# EAGLE design bottle-light (EAGLE 9.4.2)
DATE: 04.07.2019; EDITOR: Hans Achterbahn; LICENSE: MIT License; PROJECT: Bottle Light; VERSION: v0.2.8

## Sheet 1 of 2
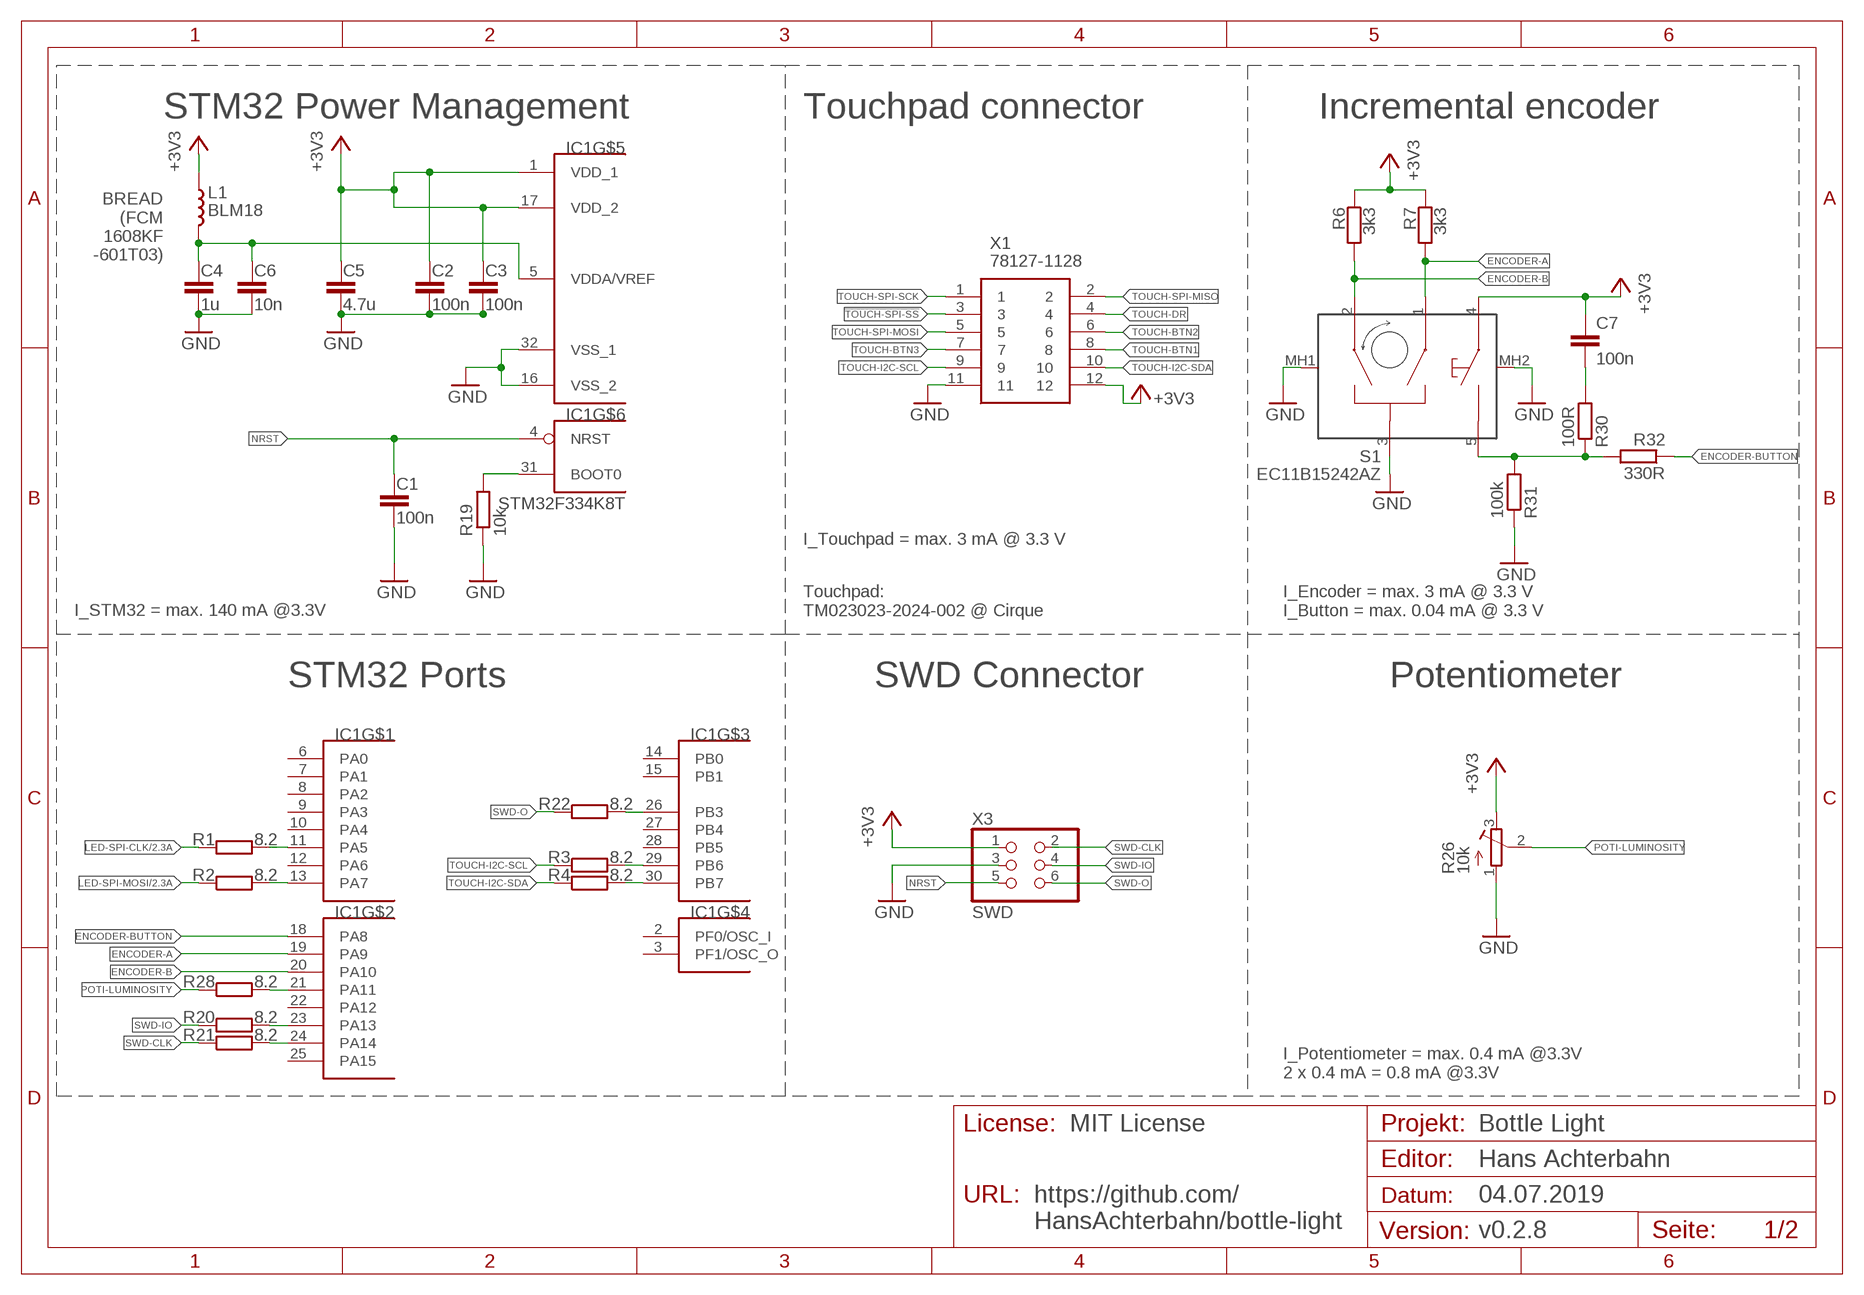
[diagram p0: schematic, sheet 1]

### Parts
C1  100n  C-EUC0603K  [C0603K]
C2  100n  C-EUC0603K  [C0603K]
C3  100n  C-EUC0603K  [C0603K]
C4  1u  C-EUC0603K  [C0603K]
C5  4.7u  C-EUC0603K  [C0603K]
C6  10n  C-EUC0603K  [C0603K]
C7  100n  C-EUC0603  [C0603]
IC1  STM32F334K8T  [LQFP32-7X7]
L1  BLM18  INDUCTOR/FERRITE-BEAD'0603'  [L0603]
R1  8.2  R-EU_R0603  [R0603]
R2  8.2  R-EU_R0603  [R0603]
R3  8.2  R-EU_R0603  [R0603]
R4  8.2  R-EU_R0603  [R0603]
R6  3k3  R-EU_R0603  [R0603]
R7  3k3  R-EU_R0603  [R0603]
R19  10k  R-EU_R0603  [R0603]
R20  8.2  R-EU_R0603  [R0603]
R21  8.2  R-EU_R0603  [R0603]
R22  8.2  R-EU_R0603  [R0603]
R26  10k  RK0971110  [RK0971110]
R28  8.2  R-EU_R0603  [R0603]
R30  100R  R-EU_R0603  [R0603]
R31  100k  R-EU_R0603  [R0603]
R32  330R  R-EU_R0603  [R0603]
S1  EC11B15242AZ  [EC11B15242AZ]
X1  78127-1128  [781271128]
X3  SWD  PINHD-2X3_2.54-SMD  [2X03SMD]

### Nets
!TOUCH-SPI-SS: X1.3
+3V3: C2.1 C3.1 C5.1 C7.1 IC1.1(VDD_1) IC1.17(VDD_2) L1.1 R6.1 R7.1 R26.3(E) S1.4(D) X1.12 X3.1 ; also sheet 2
ENCODER-A: IC1.19(PA9) R7.2 S1.1(A)
ENCODER-B: IC1.20(PA10) R6.2 S1.2(B)
ENCODER-BUTTON: IC1.18(PA8) R32.1
GND: C1.2 C2.2 C3.2 C4.2 C5.2 C6.2 IC1.16(VSS_2) IC1.32(VSS_1) R19.1 R26.1(A) R31.1 S1.3(C) S1.MH1 S1.MH2 X1.11 X3.3 ; also sheet 2
LED-SPI-CLK: R1.1 ; also sheet 2
LED-SPI-MOSI: R2.1 ; also sheet 2
N$1: IC1.24(PA14) R21.2
N$2: IC1.11(PA5) R1.2
N$3: IC1.13(PA7) R2.2
N$4: IC1.29(PB6) R3.2
N$5: IC1.30(PB7) R4.2
N$6: IC1.21(PA11) R28.2
N$7: C4.1 C6.1 IC1.5(VDDA/VREF) L1.2
N$23: IC1.31(BOOT0) R19.2
N$24: IC1.23(PA13) R20.2
N$25: IC1.26(PB3) R22.2
N$30: R30.1 R31.2 R32.2 S1.5(E)
N$31: C7.2 R30.2
NRST: C1.1 IC1.4(NRST) X3.5
POTI-LUMINOSITY: R26.2(S) R28.1
SWD-CLK: R21.1 X3.2
SWD-IO: R20.1 X3.4
SWD-O: R22.1 X3.6
TOUCH-BTN1: X1.8
TOUCH-BTN2: X1.6
TOUCH-BTN3: X1.7
TOUCH-DR: X1.4
TOUCH-I2C-SCL: R3.1 X1.9
TOUCH-I2C-SDA: R4.1 X1.10
TOUCH-SPI-MISO: X1.2
TOUCH-SPI-MOSI: X1.5
TOUCH-SPI-SCK: X1.1
Unconnected: IC1.2(PF0/OSC_I) IC1.3(PF1/OSC_O) IC1.6(PA0) IC1.7(PA1) IC1.8(PA2) IC1.9(PA3) IC1.10(PA4) IC1.12(PA6) IC1.14(PB0) IC1.15(PB1) IC1.22(PA12) IC1.25(PA15) IC1.27(PB4) IC1.28(PB5)

### Notes on the sheet
- STM32 Power Management | Touchpad connector | Incremental encoder
- BREAD
  (FCM
  1608KF
  -601T03)
- I_Touchpad = max. 3 mA @ 3.3 V
- I_STM32 = max. 140 mA @3.3V
- Touchpad:
  TM023023-2024-002 @ Cirque
- I_Encoder = max. 3 mA @ 3.3 V
  I_Button = max. 0.04 mA @ 3.3 V
- STM32 Ports | SWD Connector | Potentiometer
- I_Potentiometer = max. 0.4 mA @3.3V
  2 x 0.4 mA = 0.8 mA @3.3V
- License:
- URL:
- https://github.com/
  HansAchterbahn/bottle-light

## Sheet 2 of 2
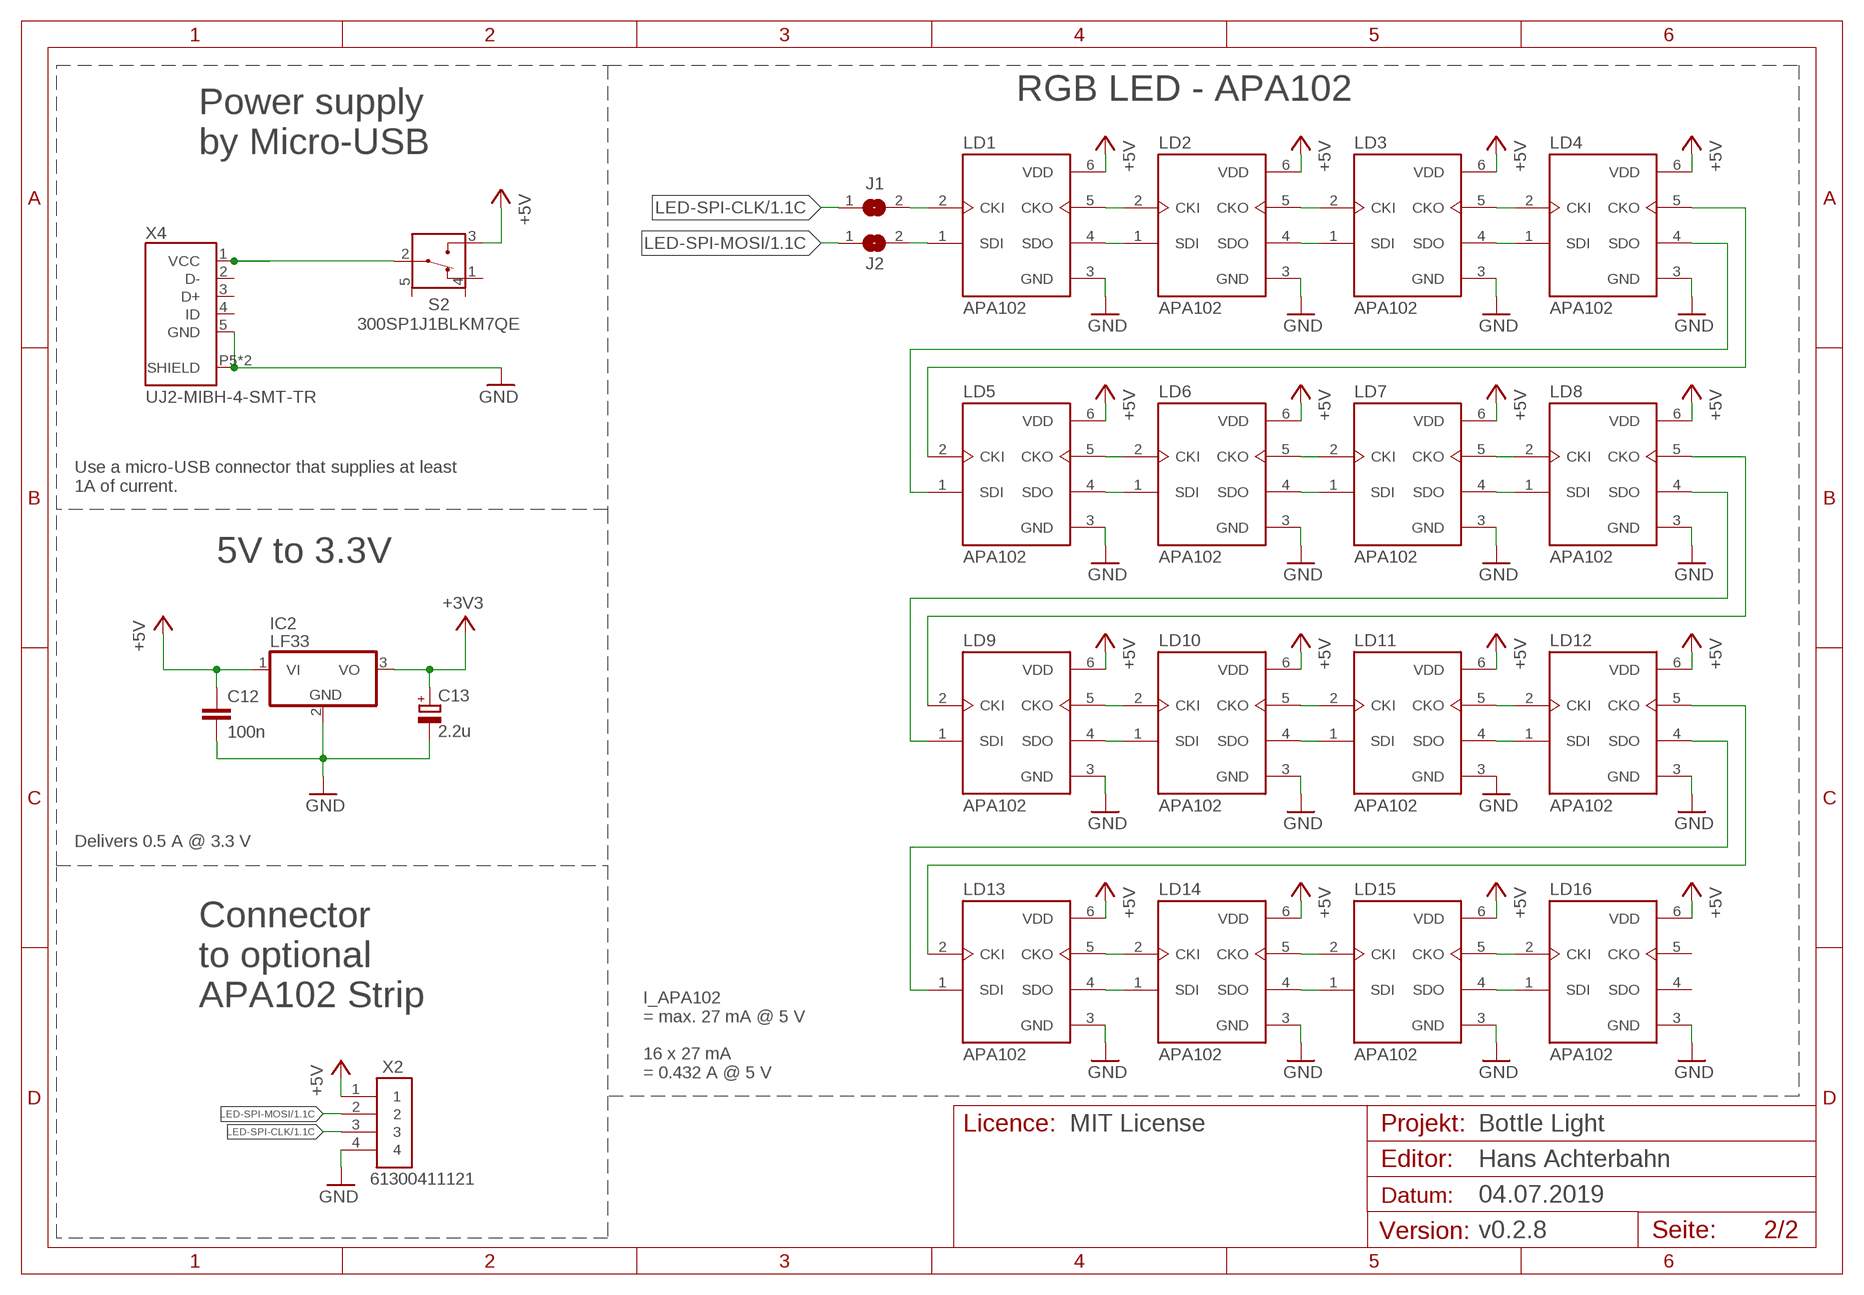
[diagram p1: schematic, sheet 2]

### Parts
C12  100n  C-EUC0603  [C0603]
C13  2.2u  CPOL-EU153CLV-0505  [153CLV-0505]
IC2  LF33  7805T  [TO220H]
J1  SJ  [SJ]
J2  SJ  [SJ]
LD1  APA102  APA102APA102C-5050  [APA102C-5050]
LD2  APA102  APA102APA102C-5050  [APA102C-5050]
LD3  APA102  APA102APA102C-5050  [APA102C-5050]
LD4  APA102  APA102APA102C-5050  [APA102C-5050]
LD5  APA102  APA102APA102C-5050  [APA102C-5050]
LD6  APA102  APA102APA102C-5050  [APA102C-5050]
LD7  APA102  APA102APA102C-5050  [APA102C-5050]
LD8  APA102  APA102APA102C-5050  [APA102C-5050]
LD9  APA102  APA102APA102C-5050  [APA102C-5050]
LD10  APA102  APA102APA102C-5050  [APA102C-5050]
LD11  APA102  APA102APA102C-5050  [APA102C-5050]
LD12  APA102  APA102APA102C-5050  [APA102C-5050]
LD13  APA102  APA102APA102C-5050  [APA102C-5050]
LD14  APA102  APA102APA102C-5050  [APA102C-5050]
LD15  APA102  APA102APA102C-5050  [APA102C-5050]
LD16  APA102  APA102APA102C-5050  [APA102C-5050]
S2  300SP1J1BLKM7QE  [300SP1J1BLKM7QE]
X2  61300411121  [61300411121]
X4  UJ2-MIBH-4-SMT-TR  UJ2-MIBH-4-SMT-TRCUIINC_UJ2-MIBH-4-SMT-TR-2  [CUIINC_UJ2-MIBH-4-SMT-TR-2]

### Nets
5V-IN: S2.2(IN) X4.1(VCC)
+3V3: C13.+ IC2.3(VO) ; also sheet 1
+5V: C12.1 IC2.1(VI) LD1.6(VDD) LD2.6(VDD) LD3.6(VDD) LD4.6(VDD) LD5.6(VDD) LD6.6(VDD) LD7.6(VDD) LD8.6(VDD) LD9.6(VDD) LD10.6(VDD) LD11.6(VDD) LD12.6(VDD) LD13.6(VDD) LD14.6(VDD) LD15.6(VDD) LD16.6(VDD) S2.3(OUT1) X2.1
GND: C12.2 C13.- IC2.2(GND) LD1.3(GND) LD2.3(GND) LD3.3(GND) LD4.3(GND) LD5.3(GND) LD6.3(GND) LD7.3(GND) LD8.3(GND) LD9.3(GND) LD10.3(GND) LD11.3(GND) LD12.3(GND) LD13.3(GND) LD14.3(GND) LD15.3(GND) LD16.3(GND) X2.4 X4.5(GND) X4.P5(SHIELD) X4.P6(SHIELD) ; also sheet 1
LED-SPI-CLK: J1.1 X2.3 ; also sheet 1
LED-SPI-MOSI: J2.1 X2.2 ; also sheet 1
N$8: J1.2 LD1.2(CKI)
N$9: J2.2 LD1.1(SDI)
N$37: LD1.5(CKO) LD2.2(CKI)
N$39: LD1.4(SDO) LD2.1(SDI)
N$40: LD2.5(CKO) LD3.2(CKI)
N$41: LD2.4(SDO) LD3.1(SDI)
N$42: LD3.5(CKO) LD4.2(CKI)
N$43: LD3.4(SDO) LD4.1(SDI)
N$44: LD4.5(CKO) LD5.2(CKI)
N$45: LD4.4(SDO) LD5.1(SDI)
N$46: LD5.5(CKO) LD6.2(CKI)
N$47: LD5.4(SDO) LD6.1(SDI)
N$48: LD6.5(CKO) LD7.2(CKI)
N$49: LD6.4(SDO) LD7.1(SDI)
N$50: LD7.5(CKO) LD8.2(CKI)
N$51: LD7.4(SDO) LD8.1(SDI)
N$52: LD8.5(CKO) LD9.2(CKI)
N$53: LD8.4(SDO) LD9.1(SDI)
N$54: LD9.5(CKO) LD10.2(CKI)
N$55: LD9.4(SDO) LD10.1(SDI)
N$56: LD10.5(CKO) LD11.2(CKI)
N$57: LD10.4(SDO) LD11.1(SDI)
N$58: LD11.5(CKO) LD12.2(CKI)
N$59: LD11.4(SDO) LD12.1(SDI)
N$60: LD12.5(CKO) LD13.2(CKI)
N$61: LD12.4(SDO) LD13.1(SDI)
N$62: LD13.5(CKO) LD14.2(CKI)
N$63: LD13.4(SDO) LD14.1(SDI)
N$64: LD14.5(CKO) LD15.2(CKI)
N$65: LD14.4(SDO) LD15.1(SDI)
N$66: LD15.5(CKO) LD16.2(CKI)
N$67: LD15.4(SDO) LD16.1(SDI)
Unconnected: LD16.4(SDO) LD16.5(CKO) S2.1(OUT2) S2.4(NC1) S2.5(NC2) X4.2(D-) X4.3(D+) X4.4(ID)

### Notes on the sheet
- RGB LED - APA102
- Power supply
  by Micro-USB
- Use a micro-USB connector that supplies at least 
  1A of current.
- 5V to 3.3V
- Delivers 0.5 A @ 3.3 V
- Connector 
  to optional 
  APA102 Strip
- I_APA102
  = max. 27 mA @ 5 V
  
  16 x 27 mA 
  = 0.432 A @ 5 V
- Licence:

## Library data of the parts
C1-C3 = resistor:C-EU: CAPACITOR, European symbol; RS-ONLINE: 391-246
C4 = resistor:C-EU: CAPACITOR, European symbol; RS-ONLINE: 435-1403
C5 = resistor:C-EU: CAPACITOR, European symbol; RS-ONLINE: 691-1164
C6 = resistor:C-EU: CAPACITOR, European symbol; RS-ONLINE: 264-4595
C7 = resistor:C-EU: CAPACITOR, European symbol; MOUSER: 581-0603YC104J; ORIGINAL: AVX, 0603YC104JAT2A; RS-ONLINE: 391-246
C12 = rcl:C-EU: CAPACITOR, European symbol; SPICEPREFIX: C
C13 = rcl:CPOL-EU: POLARIZED CAPACITOR, European symbol; SPICEPREFIX: C
IC1 = h8-stm32:STM32F334K8T: STM32 Mikrocontroller: STM32F334K8Tx Documentary, Reference Manual and Datasheet: http://www.st.com/en/microcontrollers/stm32f334k8.html Created by Hans Achterbahn (https://github.com/HansAchterbahn)
IC2 = linear:78*: Positive VOLTAGE REGULATOR Source: http://cache.national.com/ds/LM/LM78L05.pdf http://www.fairchildsemi.com/ds/LM/LM7805.pdf
J1 J2 = jumper:SJ: SMD solder JUMPER
L1 = Seeed-OPL-Inductor:INDUCTOR/FERRITE-BEAD; MF: Murata; MFN: BLM18KG601SN1D; MOUSER: 81-BLM18KG601SN1D; RS-ONLINE: 747-4720
LD1-LD16 = h8-optic:APA102: DotStar Micro LEDs (APA102–2020)- Smart SMD RGB LED - 100 pack
R1-R4 R20-R22 R28 = resistor:R-EU_: RESISTOR, European symbol; RS-ONLINE: 904-5027
R6 R7 = rcl:R-EU_: RESISTOR, European symbol; MF: Vishay; MFN: CRCW06032K70FKEAC; MOUSER: 71-CRCW06032K70FKEAC; RS-ONLINE: -; SPICEPREFIX: R
R19 = resistor:R-EU_: RESISTOR, European symbol
R26 = h8-rlc:RK0971110: Potentiometer Manufacturer: Alps Part Nr.: RK097111080R Datasheet: https://www.mouser.de/datasheet/2/15/RK097-1370742.pdf Distributor: RS-Online: 729-3458 <https://de.rs-online.com/web/p/potenziometer/7293458/> Mouser: 688-RK097111080R <https://www.mouser.de/ProductDetail/ALPS/RK097111080R?qs=%2Fha2pyFaduhU4k0V7XWN8mIkeNZb2knvSkahcQwzToaQdR6BkxtXDw%3D%3D> Created by Hans Achterbahn (https://github.com/HansAchterbahn); MF: ALPS; MFN: RK097111080R; MOUSER: 688-RK097111080R; RS-ONLINE: 729-3458
R30 = rcl:R-EU_: RESISTOR, European symbol; MOUSER: 71-CRCW0603-100-E3; ORIGINAL: Vishay, CRCW0603100RFKEAHP; RS-ONLINE: 820-6748; SPICEPREFIX: R
R31 = rcl:R-EU_: RESISTOR, European symbol; MOUSER: 71-CRCW0603-100K-E3; ORIGINAL: Vishay, CRCW0603100KFKEA; RS-ONLINE: 678-9673; SPICEPREFIX: R
R32 = rcl:R-EU_: RESISTOR, European symbol; MOUSER: 71-CRCW0603-330-E3; ORIGINAL: Vishay, CRCW0603330RFKEA; RS-ONLINE: 679-0226; SPICEPREFIX: R
S1 = h8-switch:EC11B15242AZ: Komponente von www.SamacSys.com geforkt: https://componentsearchengine.com/part.php?partID=1029460&p=1 Encoders 5 Volts Through Hole Source: Datasheet <https://componentsearchengine.com/Datasheets/1/EC11B15242AZ.pdf> Edited by Hans Achterbahn (https://github.com/HansAchterbahn); DESCRIPTION: Encoders 5 Volts Through Hole; HEIGHT: 24mm; MANUFACTURER_NAME: ALPS; MANUFACTURER_PART_NUMBER: EC11B15242AZ; MF: ALPS; MOUSER: 688-EC11B15242AE; MOUSER_PART_NUMBER: 688-EC11B15242AE; MOUSER_PRICE-STOCK: https://www.mouser.com/Search/Refine.aspx?Keyword=688-EC11B15242AE; MPN: EC11B15242AZ
S2 = h8-switch:300SP1J1BLKM7QE: E-Switch - 300 Series Rocker Switch Production Data Manufacturer: E-Switch Part Number: 300SP1J1BLKM7QE Distributer: RS-Online: - Mouser: 612-300SP1J1BLKM7QE Datasheet: https://www.mouser.de/datasheet/2/140/300-346108.pdf Created by Hans Achterbahn (https://github.com/HansAchterbahn); MF: E-Switch; MFN: 300SP1J1BLKM7QE; MOUSER: 612-300SP1J1BLKM7QE; RS-ONLINE: -
X1 = h8-conector:78127-1128: FFC & FPC Connectors 0.5 FPC CONN. VERTIC AL SMT NON-ZIF 12CKT Source: Datasheet <https://www.molex.com/pdm_docs/sd/781271128_sd.pdf>; ALLIED_NUMBER: 70714305; ALLIED_PRICE-STOCK: https://www.alliedelec.com/molex-incorporated-78127-1128/70714305/; DESCRIPTION: FFC & FPC Connectors 0.5 FPC CONN. VERTIC AL SMT NON-ZIF 12CKT; HEIGHT: 4mm; MANUFACTURER_NAME: Molex; MANUFACTURER_PART_NUMBER: 78127-1128; MOUSER_PART_NUMBER: 538-78127-1128; MOUSER_PRICE-STOCK: https://www.mouser.com/Search/Refine.aspx?Keyword=538-78127-1128
X2 = Headers:61300411121: CONN HEADER VERT 4POS 2.54MM Manufacturer's datasheet <https://katalog.we-online.de/em/datasheet/6130xx11121.pdf>; CREATED_BY: PCBLayout.com; DIGI_KEY_PART_NUMBER: 732-5317-ND; MANUFACTURER: Wurth Electronics Inc.; MPN: 61300411121
X3 = h8-pinhead:PINHD-2X3: PIN HEADER; MOUSER: 855-M20-8760342; ORIGINAL: Harwin, M20-8760342; RS-ONLINE: 681-2880
X4 = UJ2-MIBH-4-SMT-TR:UJ2-MIBH-4-SMT-TR: Micro B Type 5 Pin Horizontal 30 µin Plating SMT USB Jack 2.0; DATASHEET: https://www.mouser.de/datasheet/2/670/uj2-mibh-4-smt-1313358.pdf; MF: CUI; MFN: UJ2-MIBH-4-SMT-TR; MOUSER: 490-UJ2-MIBH-4-SMT

## Net classes
0 default: width 0.2 mm, drill 0.2 mm, clearance 0.15 mm
1 Power: width 0.2 mm, drill 0.2 mm, clearance 0.15 mm

## Board
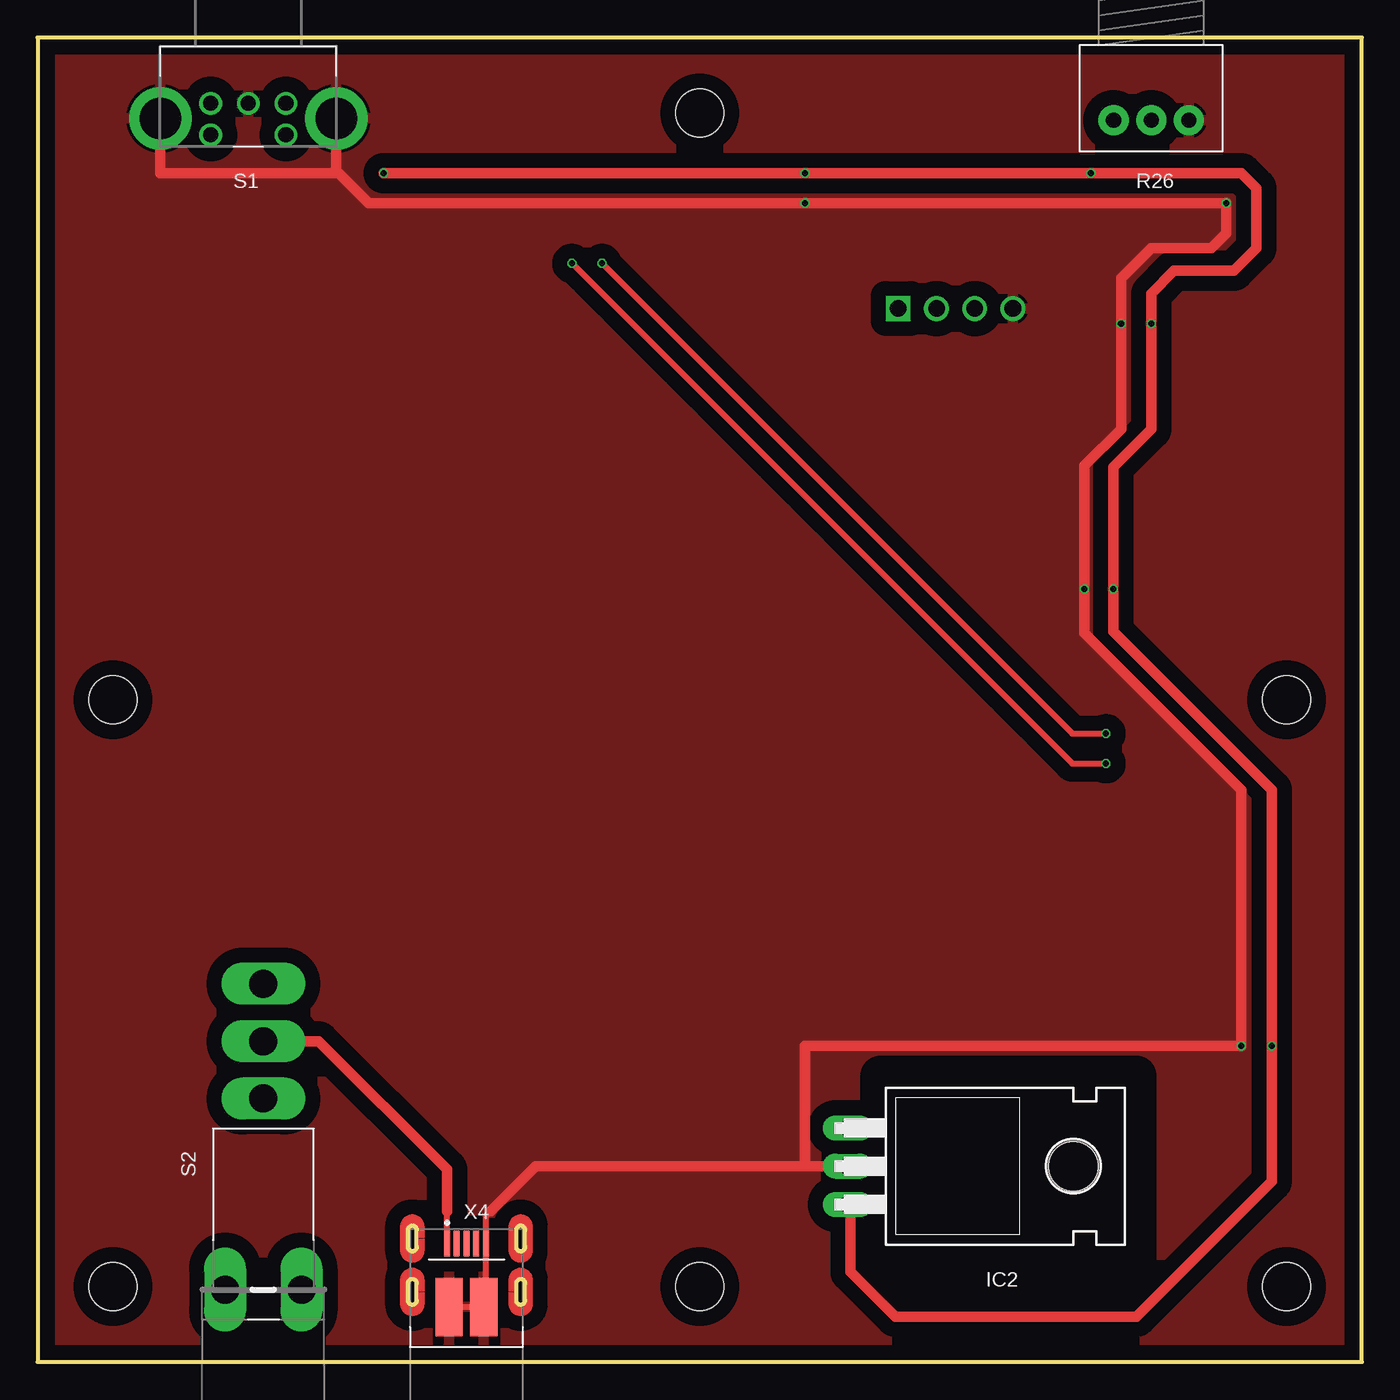
[diagram p2: board, top side]
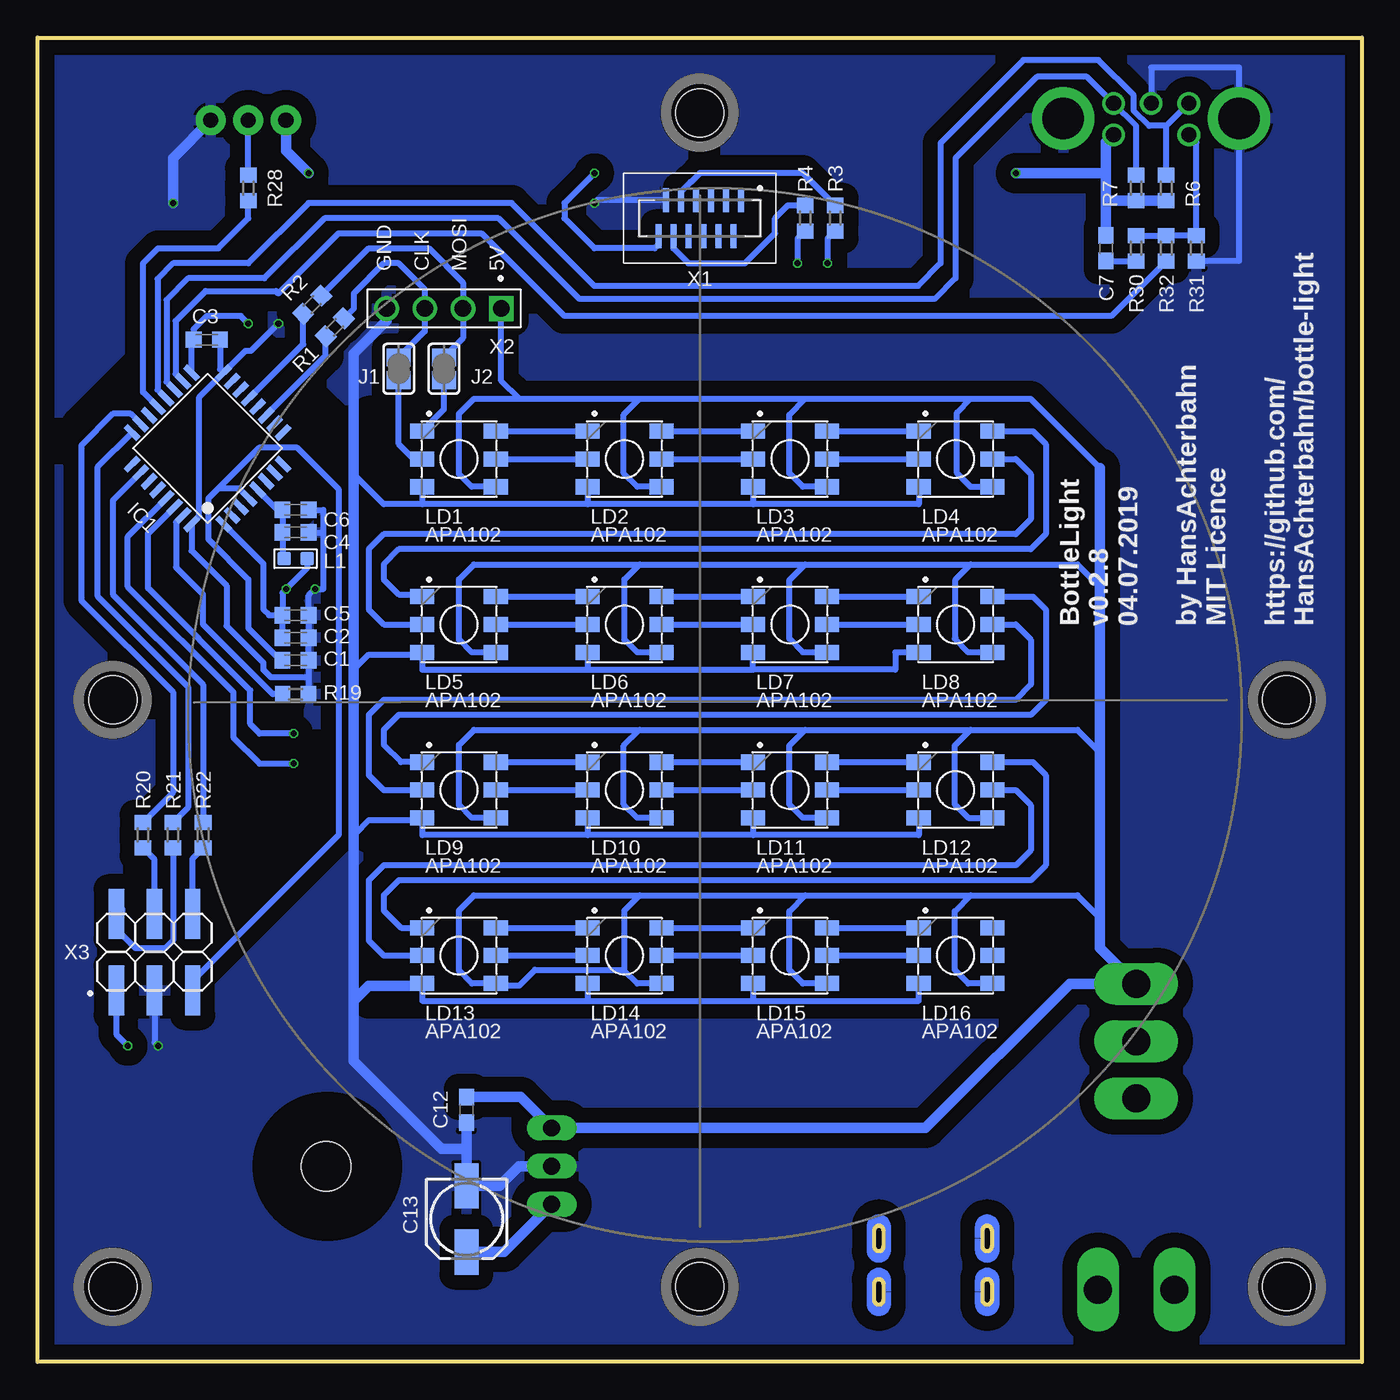
[diagram p3: board, bottom side, seen from below]

Size 88 x 88 mm. Coordinates in mm from the lower left corner, seen from the top.
Outline: 0,0 88,0 88,88 0,88 0,0
Outline: 24.9,9.05 arc90 24.6,8.75 24.6,7.65 arc90 24.9,7.35 arc90 25.2,7.65 25.2,8.75 arc90 24.9,9.05
Outline: 32.4,8.75 arc90 32.1,9.05 arc90 31.8,8.75 31.8,7.65 arc90 32.1,7.35 arc90 32.4,7.65 32.4,8.75
Outline: 32.4,5.2 arc90 32.1,5.5 arc90 31.8,5.2 31.8,4.1 arc90 32.1,3.8 arc90 32.4,4.1 32.4,5.2
Outline: 25.2,5.2 arc90 24.9,5.5 arc90 24.6,5.2 24.6,4.1 arc90 24.9,3.8 arc90 25.2,4.1 25.2,5.2
Copper layers (1*16): Top 0.018mm / dielectric 1.55mm / Bottom 0.018mm
Design rules "Multi-CB_2L_100æm-Tracks_OL35æm": minimum track width 0.1mm, minimum drill 0.2mm, track to track 0.1mm, track to pad 0.1mm, pad to pad 0.1mm, via to via 0.1mm, smd to smd 0mil, copper to edge 0.2mm, drill to drill 0.2mm, minimum pad ring 0.125mm, minimum via ring 0.1mm, stop-mask expansion 2mil, vias tented up to drill 0.45mm, thermal gap 0.2mm
Holes 3.2 mm at 83,5 5,5 5,44 44,5 83,44 44,83
tRestrict: area 56,7 to 73,19
bRestrict: area 65.1,9.4 to 72.4,16.6; area 68.3,50.8 to 85.1,70.6; area 21,57 to 66,63; area 21,46 to 66,52; area 21,35 to 66,41; area 21,24 to 66,30

### Footprints (pad centres in the part's own frame; a part is rotated, then mirrored left to right if it is on the bottom)
C0603K = smd 1.05 x 1.08: 1 -0.875,0; 2 0.875,0
C0603 = smd 1.1 x 1: 1 -0.85,0; 2 0.85,0
153CLV-0505 = smd 3 x 1.6: + 2.2,0; - -2.2,0
LQFP32-7X7 = smd 1.2 x 0.4: 1 -4.3,2.8; 2 -4.3,2; 3 -4.3,1.2; 4 -4.3,0.4; 5 -4.3,-0.4; 6 -4.3,-1.2; 7 -4.3,-2; 8 -4.3,-2.8; 17 4.3,-2.8; 18 4.3,-2; 19 4.3,-1.2; 20 4.3,-0.4; 21 4.3,0.4; 22 4.3,1.2; 23 4.3,2; 24 4.3,2.8 | smd 0.4 x 1.2: 9 -2.8,-4.3; 10 -2,-4.3; 11 -1.2,-4.3; 12 -0.4,-4.3; 13 0.4,-4.3; 14 1.2,-4.3; 15 2,-4.3; 16 2.8,-4.3; 25 2.8,4.3; 26 2,4.3; 27 1.2,4.3; 28 0.4,4.3; 29 -0.4,4.3; 30 -1.2,4.3; 31 -2,4.3; 32 -2.8,4.3
TO220H = drill 1.118 long: 1 -2.54,-10.16; 2 0,-10.16; 3 2.54,-10.16 | hole 3.302: 0,4.826
SJ = smd 1.168 x 1.6: 1 -0.762,0; 2 0.762,0
L0603 = smd 0.889 x 0.889: 1 -0.762,0; 2 0.762,0
APA102C-5050 = smd 1.6 x 1: 1 -2.45,1.85; 2 -2.45,0; 3 -2.45,-1.85; 4 2.45,1.85; 5 2.45,0; 6 2.45,-1.85
R0603 = smd 1 x 1.1: 1 -0.85,0; 2 0.85,0
RK0971110 = drill 1 pad 2: 1 2.5,0; 2 0,0; 3 -2.5,0
EC11B15242AZ = drill 1 pad 1.5: 1 -10.363,-2.5; 2 -10.363,2.5; 3 -10.363,0; 4 -12.463,-2.5; 5 -12.463,2.5 | drill 2.766 pad 4.149: MH1 -11.363,5.85; MH2 -11.363,-5.85
300SP1J1BLKM7QE = drill 1.854 long: 1 0,0; 2 -3.81,0; 3 -7.62,0; 4 12.7,2.54; 5 12.7,-2.54
781271128 = smd 0.4 x 1.6: 1 -2.75,-1.2; 2 -2.25,1.2; 3 -1.75,-1.2; 4 -1.25,1.2; 5 -0.75,-1.2; 6 -0.25,1.2; 7 0.25,-1.2; 8 0.75,1.2; 9 1.25,-1.2; 10 1.75,1.2; 11 2.25,-1.2; 12 2.75,1.2
61300411121 = drill 1.1 square: 1 -3.81,0 | drill 1.1: 2 -1.27,0; 3 1.27,0; 4 3.81,0
2X03SMD = smd 1.016 x 3.302: 1 -1.27,-3.81; 2 -1.27,1.27; 3 1.27,-3.81; 4 1.27,1.27; 5 3.81,-3.81; 6 3.81,1.27
CUIINC_UJ2-MIBH-4-SMT-TR-2 = smd 0.4 x 1.7: 1 1.3,-6.85; 2 0.65,-6.85; 3 0,-6.85; 4 -0.65,-6.85; 5 -1.3,-6.85 | smd 1.8 x 3.9: P5 -1.15,-2.65; P6 1.15,-2.65

### Placement (x,y rotation side)
C1  70.86,46.62 0 bottom
C2  70.86,48.12 0 bottom
C3  76.76,67.93 0 bottom
C4  70.86,55.12 0 bottom
C5  70.86,49.62 0 bottom
C6  70.86,56.62 0 bottom
C7  17,74 270 bottom
C12  59.5,16.75 270 bottom
C13  59.5,9.5 270 bottom
IC1  76.71,60.71 135 bottom
IC2  64,13 270 top
J1  64,66 270 bottom
J2  61,66 270 bottom
L1  70.86,53.37 180 bottom
LD1  60,60 0 bottom
LD2  49,60 0 bottom
LD3  38,60 0 bottom
LD4  27,60 0 bottom
LD5  60,49 0 bottom
LD6  49,49 0 bottom
LD7  38,49 0 bottom
LD8  27,49 0 bottom
LD9  60,38 0 bottom
LD10  49,38 0 bottom
LD11  38,38 0 bottom
LD12  27,38 0 bottom
LD13  60,27 0 bottom
LD14  49,27 0 bottom
LD15  38,27 0 bottom
LD16  27,27 0 bottom
R1  68.25,68.75 225 bottom
R2  69.75,70.25 225 bottom
R3  35,76 270 bottom
R4  37,76 270 bottom
R6  13,78 90 bottom
R7  15,78 90 bottom
R19  70.86,44.37 180 bottom
R20  81,35 90 bottom
R21  79,35 90 bottom
R22  77,35 90 bottom
R26  74,82.5 0 top
R28  74,78 270 bottom
R30  15,74 270 bottom
R31  11,74 90 bottom
R32  13,74 90 bottom
S1  14,94 90 top
S2  15,17.5 270 top
U$1  [A4L-LOC]  -85,-45 0 top  (outside the outline)
X1  44,76 180 bottom
X2  61,70 180 bottom
X3  81.5,28.5 0 bottom
X4  28.5,1 180 top

### Tracks (layer width: path | path; a pad name or v marks a point on that pad's centre or on a via)
5V-IN
  Top 0.406: X4.1 27.2,10
  Top 0.7: 27.2,10 27.2,12.8 18.69,21.31 S2.2
+3V3  (via drill 0.4)
  Top 0.7: v23,79 v51,79 v70,79 80,79 81,78 81,74 79.5,72.5 75.5,72.5 74,71 v74,69 74,62 71.47,59.47 v71.47,51.37 71.47,48.53 82,38 v82,21 82,12 73,3 57,3 54,6 54,10.3 IC2.3
  Bottom 0.4: X3.1 82.77,21.77 v82,21 | IC1.17 77.77,67.79 C3.1 77.63,68.62 76.75,69.5 74.5,69.5 v74,69 | v51,79 53,77 53,76 51,74 47,74 46.75,74.25 X1.12 | C5.1 72.62,49.62 73,50 73,53.04 IC1.1 | L1.1 70.09,52.75 v71.47,51.37 71.73,51.11 C5.1 | C2.1 C5.1 | C5.1
  Bottom 0.7: S1.4 17,81.04 17,79 | 17,79 17,77 | 17,77 C7.1 | R6.1 R7.1 16.85,77.15 17,77 | v23,79 17,79 | v70,79 71.5,80.5 R26.3 | C13.+ 57,7.3 IC2.3
+5V
  Bottom 0.4: LD15.6 37.15,25.15 38.05,26.05 38.05,29.95 37,31 | LD16.6 26.15,25.15 27.05,26.05 27.05,29.95 26,31 | LD14.6 48.15,25.15 49.05,26.05 | 49.05,26.05 54.95,26.05 56,25 57.4,25 LD13.6 59.15,25.15 60,26 60,30 59,31 48,31 | LD12.6 26.15,36.15 27.05,37.05 27.05,40.95 26,42 | LD11.6 37.15,36.15 38.05,37.05 38.05,40.95 37,42 | LD10.6 48.15,36.15 49.05,37.05 49.05,40.95 48,42 | LD3.6 37.15,58.15 38.05,59.05 38.05,62.95 37,64 | LD2.6 48.15,58.15 49.05,59.05 49.05,62.95 48,64 | LD8.6 26.15,47.15 27.05,48.05 27,48.11 27,52 26,53 | LD7.6 37.15,47.15 38.05,48.05 38.05,51.95 37,53 | LD4.6 26,58.15 26.9,59.05 26.9,63.1 26,64 | 17.4,59.39 22.02,64 26,64 | 56,64 59,64 60,63 60,59 59.15,58.15 LD1.6 | 56,64 48,64 | 48,64 37,64 | 37,64 26,64 | 17.4,51.5 18.9,53 26,53 | 48,53 59,53 60,52 60,48 59.15,47.15 LD5.6 | 48,53 37,53 | 37,53 26,53 | LD6.6 48.15,47.15 49,48 49,52 48,53 | 17.4,40.5 18.9,42 26,42 | 48,42 59,42 60,41 60,37 59.15,36.15 LD9.6 | 48,42 37,42 | 37,42 26,42 | 17.4,29.5 18.9,31 26,31 | 48,31 37,31 | 37,31 26,31 | 49.05,26.05 49,26.11 49,30 48,31 | X2.1 57.19,65.19 56,64
  Bottom 0.7: 17.4,59.39 17.4,51.5 17.4,40.5 17.4,29.5 17.4,27.52 S2.3 19.42,25.12 29,15.54 IC2.1 55.9,17.6 C12.1
ENCODER-A
  Bottom 0.4: R7.2 15,82.14 S1.1 18.26,85.4 21.6,85.4 27,80 27,72 28.38,70.62 52,70.62 57.38,76 68.93,76 72.93,72 78,72 79.43,70.57 79.43,65.13 IC1.19
ENCODER-B
  Bottom 0.4: R6.2 13,82.14 | S1.2 13,82.14 | 13,82.14 14.14,82.14 15.16,83.16 15.16,84.16 17.5,86.5 22.5,86.5 28,81 28,73 29.5,71.5 51,71.5 56.5,77 70,77 74,73 79,73 80.03,71.97 80.03,64.6 IC1.20
ENCODER-BUTTON
  Bottom 0.4: IC1.18 78.83,65.66 78.83,69.17 76.85,71.15 72.15,71.15 72,71 68,75 58.5,75 53,69.5 16.65,69.5 R32.1
GND  (via drill 0.4)
  Top 0.4: 30.1,10 29.8,9.7 X4.5 29.8,2.8 X4.P5 X4.P6
  Top 0.7: 30.1,10 33.1,13 51,13 | 51,13 IC2.2 | S1.MH2 19.85,79 | 19.85,79 20,79 22,77 v51,77 v79,77 79,75 78,74 74,74 72,72 v72,69 72,62 69.57,59.57 v69.57,51.37 69.57,48.43 80,38 v80,21 51,21 51,13 | 19.85,79 8.15,79 S1.MH1
  Bottom 0.4: 40.45,57 29.45,57 LD4.3 | 40.45,57 51.45,57 | 51.45,57 62.45,57 | 40.45,46 31,46 31,47.15 LD8.3 | 51.45,46 40.45,46 | 51.45,46 62.45,46 LD5.3 62.6,47 66,47 67,46 | 40.45,35 29.45,35 LD12.3 | 40.45,35 51.45,35 | 51.45,35 62.45,35 LD9.3 62.6,36 66,36 66.85,35.15 67,35.15 | 62.6,25 LD13.3 62.45,24 51.45,24 | 40.45,46 LD7.3 | LD6.3 51.45,46 | LD10.3 51.45,35 | LD11.3 40.45,35 | LD16.3 29.45,24 40.45,24 | LD15.3 40.45,24 | LD14.3 51.45,24 | 51.45,24 40.45,24 | LD1.3 62.45,57 | LD2.3 51.45,57 | LD3.3 40.45,57 | S1.3 14,86 8.15,86 S1.MH1 8.15,73.15 R31.1 | X3.3 80.23,21.23 v80,21 | v72,69 73.81,67.19 74.19,67.19 IC1.16 | C3.2 75.88,65.96 IC1.16 | IC1.16 77.25,64.12 77.25,56.2 IC1.32 77.77,53.91 75.44,51.58 75.44,48.91 73,46.47 73,46 72.5,45.5 70.01,45.5 | X1.11 50.8,77.2 v51,77 | 70.01,45.5 R19.1 | 69,55.12 69,51.37 v69.57,51.37 69.98,50.96 C5.2 | 69,55.12 69,56.62 C6.2 | C4.2 69,55.12 | C5.2 | C5.2 C2.2 C1.2 70.01,46.6 70.01,45.5 | 67,59 65,57 62.45,57
  Bottom 0.7: 62.6,25 66,25 67,24 | 67,24 67,35.15 67,46 67,59 67,67 64.81,69.19 X2.4 | C12.2 59.5,14.15 | R26.1 79,80 v79,77 | 59.5,14.15 61.15,14.15 67,20 67,24 | 55.94,13 IC2.2 56,13 57.3,11.7 C13.- 59.5,14.15
  pour Top (isolate 1): 0,88 0,0 88,0 88,88
  pour Bottom (isolate 1): 0,88 88,88 88,0 0,0
LED-SPI-CLK
  Bottom 0.4: R1.1 67,70 67,71 65,73 64,73 62.27,71.27 X2.3 62.27,68.49 J1.1
LED-SPI-MOSI
  Bottom 0.4: R2.1 66,74 62,74 59.73,71.73 X2.2 59.73,68.03 J2.1
N$1
  Bottom 0.4: R21.2 78,36.85 78,44.85 84,50.85 84,59.49 IC1.24
N$2
  Bottom 0.4: IC1.11 68.85,66.87 R1.2
N$3
  Bottom 0.4: R2.2 70.35,67.63 IC1.13
N$4  (via drill 0.4)
  Top 0.4: v71,39.75 68.75,39.75 v35.5,73
  Bottom 0.4: R3.2 35.5,74.65 v35.5,73 | IC1.29 82,54.85 82,51.5 75,44.5 75,41.5 73.25,39.75 v71,39.75
N$5  (via drill 0.4)
  Top 0.4: v71,41.75 68.75,41.75 v37.5,73
  Bottom 0.4: IC1.30 80.66,55.06 80.66,51.41 73.88,44.62 73.88,42.38 73.25,41.75 v71,41.75 | R4.2 37.5,74.65 v37.5,73
N$6
  Bottom 0.4: R28.2 74,76 76,74 80,74 81,73 81,64.43 IC1.21
N$7
  Bottom 0.4: IC1.5 72.06,56.62 C6.1 C4.1 71.73,53.48 L1.2
N$8
  Bottom 0.4: LD1.2 63,60 64,61 J1.2
N$9
  Bottom 0.4: LD1.1 61,63.3 J2.2
N$23
  Bottom 0.4: R19.2 72.37,44.37 77,49 77,51 78.79,52.79 78.79,55.79 IC1.31
N$24
  Bottom 0.4: IC1.23 81.83,63 83,63 85.1,60.9 85.1,50.6 79,44.5 79,37.85 R20.2
N$25
  Bottom 0.4: R22.2 77,45 83,51 83,57.24 IC1.26
N$30
  Bottom 0.4: R30.1 R32.2 R31.2 11,81.04 S1.5
N$31
  Bottom 0.4: C7.2 R30.2
N$37
  Bottom 0.4: LD1.5 LD2.2
N$39
  Bottom 0.4: LD1.4 LD2.1
N$40
  Bottom 0.4: LD2.5 LD3.2
N$41
  Bottom 0.4: LD2.4 LD3.1
N$42
  Bottom 0.4: LD3.5 LD4.2
N$43
  Bottom 0.4: LD3.4 LD4.1
N$44
  Bottom 0.4: LD4.5 23,60 22,59 22,56 23,55 65,55 66,54 66,53.94 66,50 65,49 LD5.2
N$45
  Bottom 0.4: LD4.4 21.85,61.85 21,61 21,55 22,54 64,54 65,53 65,52 64,51 62.6,51 LD5.1
N$46
  Bottom 0.4: LD5.5 LD6.2
N$47
  Bottom 0.4: LD5.4 LD6.1
N$48
  Bottom 0.4: LD6.5 LD7.2
N$49
  Bottom 0.4: LD6.4 LD7.1
N$50
  Bottom 0.4: LD7.5 LD8.2
N$51
  Bottom 0.4: LD7.4 LD8.1
N$52
  Bottom 0.4: LD8.5 23,49 22,48 22,45 23,44 65,44 66,43 66,39 65,38 LD9.2
N$53
  Bottom 0.4: LD8.4 21.85,50.85 21,50 21,44 22,43 64,43 65,42 65,41 63.85,39.85 LD9.1
N$54
  Bottom 0.4: LD9.5 LD10.2
N$55
  Bottom 0.4: LD9.4 LD10.1
N$56
  Bottom 0.4: LD10.5 LD11.2
N$57
  Bottom 0.4: LD10.4 LD11.1
N$58
  Bottom 0.4: LD11.5 LD12.2
N$59
  Bottom 0.4: LD11.4 LD12.1
N$60
  Bottom 0.4: LD12.5 23,38 22,37 22,34 23,33 65,33 66,32 66,28 65,27 LD13.2
N$61
  Bottom 0.4: LD12.4 21.85,39.85 21,39 21,33 22,32 64,32 65,31 65,30 63.85,28.85 LD13.1
N$62
  Bottom 0.4: LD13.5 LD14.2
N$63
  Bottom 0.4: LD13.4 LD14.1
N$64
  Bottom 0.4: LD14.5 LD15.2
N$65
  Bottom 0.4: LD14.4 LD15.1
N$66
  Bottom 0.4: LD15.5 LD16.2
N$67
  Bottom 0.4: LD15.4 LD16.1
NRST
  Bottom 0.4: IC1.4 74.6,58.04 76,58.04 | 76,58.04 76.65,57.39 76.65,54.65 74,52 74,48.76 71.92,46.68 71.79,46.68 C1.1 | 76,58.04 73.29,60.75 70.75,60.75 68,58 68,35 77.69,25.31 X3.5
POTI-LUMINOSITY
  Bottom 0.4: R28.1 R26.2
SWD-CLK
  Bottom 0.4: 82.5,30.04 82.5,28.5 81.5,27.5 79.5,27.5 79,28 R21.1
  Bottom 0.7: X3.2 82.5,30.04
SWD-IO
  Bottom 0.4: X3.4 80.23,33.38 R20.1
SWD-O
  Bottom 0.4: X3.6 77.69,33.46 R22.1
TOUCH-I2C-SCL
  Bottom 0.4: X1.9 45.25,77.77 44.62,78.4 44.6,78.4 44,79 37.15,79 R3.1
TOUCH-I2C-SDA
  Bottom 0.4: X1.10 45.75,74 44.75,73 41,73 39,75 39,76 38.15,76.85 R4.1

### Text on the board
bPlace: 5V | MOSI | CLK | GND
bNames: BottleLight / v0.2.8 / 04.07.2019 / / by HansAchterbahn / MIT Licence / / https://github.com/ / HansAchterbahn/bottle-light
tTest: Bottle Light | by HansAchterbahn / v 0.1.3 | 10/07/2017